# Altium schematic sheet pump_oil_schematic.SchDoc
size A3
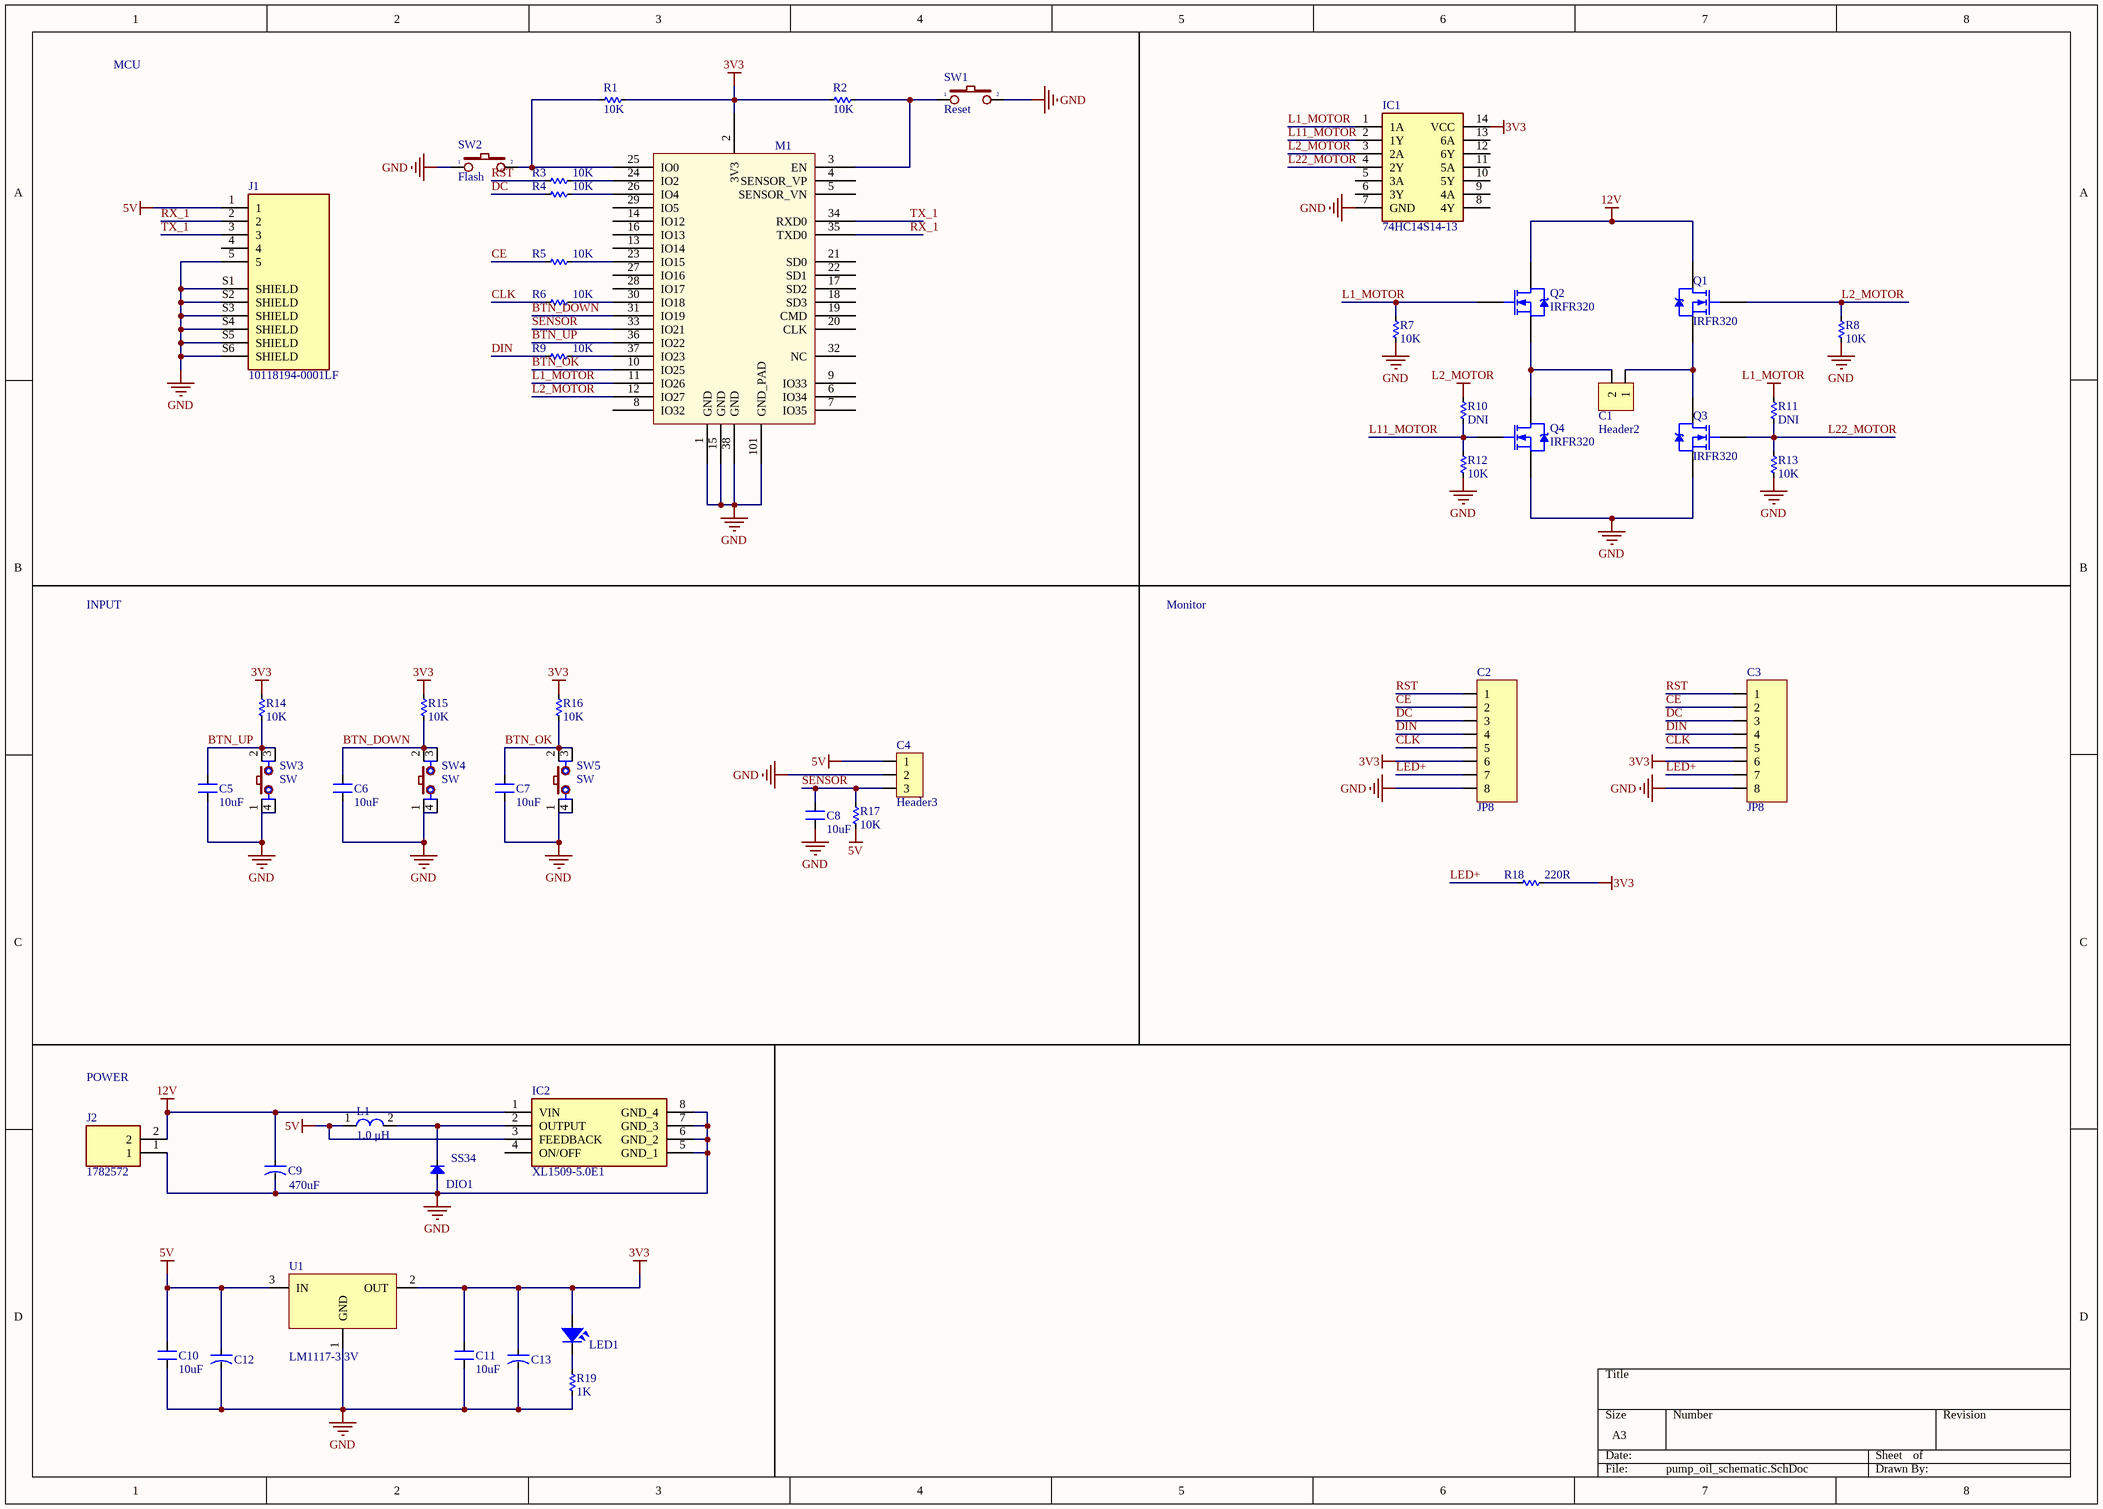
[diagram p0: pump_oil_schematic.SchDoc]

## Parts
C1  Header2  [Header2]
C2  JP8  [JP8-C1T]
C3  JP8  [JP8-C1T]
C4  Header3  [Header3]
C5  10uF  [CN-SMD-0603]
C6  10uF  [CN-SMD-0603]
C7  10uF  [CN-SMD-0603]
C8  10uF  [CN-SMD-0603]
C9  470uF  [CAP-ALU-SMD-6.3x7.7x2.2]
C10  10uF  [CN-SMD-0603]
C11  10uF  [CN-SMD-0603]
C12  CN-ALU-SMD  [CAP-ALU-SMD-4.5x5x1.4]  (value not drawn)
C13  CN-ALU-SMD  [CAP-ALU-SMD-4.5x5x1.4]  (value not drawn)
DIO1  SS34  [DIO-SMD-106]
IC1  74HC14S14-13  [SOIC127P600X173-14N]
IC2  XL1509-5.0E1  [SOIC127P600X175-8N]
J1  10118194-0001LF  [AMPHENOL_10118194-0001LF]
J2  1782572  [1782572]
L1  1.0 μH  [L-SMD-M-7.3x4.5]
LED1  LED  [LED-0805-Blue]  (value not drawn)
M1  ESP32S_Module  [ESP32S]  (value not drawn)
Q1  IRFR320  [TO-252AA_N]
Q2  IRFR320  [TO-252AA_N]
Q3  IRFR320  [TO-252AA_N]
Q4  IRFR320  [TO-252AA_N]
R1  10K  [RES-SMD-0603]
R2  10K  [RES-SMD-0603]
R3  10K  [RES-SMD-0603]
R4  10K  [RES-SMD-0603]
R5  10K  [RES-SMD-0603]
R6  10K  [RES-SMD-0603]
R7  10K  [RES-SMD-0603]
R8  10K  [RES-SMD-0603]
R9  10K  [RES-SMD-0603]
R10  DNI  [RES-SMD-0603]
R11  DNI  [RES-SMD-0603]
R12  10K  [RES-SMD-0603]
R13  10K  [RES-SMD-0603]
R14  10K  [RES-SMD-0603]
R15  10K  [RES-SMD-0603]
R16  10K  [RES-SMD-0603]
R17  10K  [RES-SMD-0603]
R18  220R  [RES-SMD-0603]
R19  1K  [RES-SMD-0603]
SW1  Reset  [SW1-SMD]
SW2  Flash  [SW-DIP1-1]
SW3  SW  [SW2-SMD]
SW4  SW  [SW2-SMD]
SW5  SW  [SW2-SMD]
U1  LM1117-3.3V  [SOT223]

## Nets
3V3: C2.6 C3.6 C11.1 C13.1 IC1.14(VCC) LED1.1 M1.2(3V3) R1.1 R2.2 R14.1 R15.1 R16.1 R18.2 U1.2(OUT)
5V: C4.1 C10.1 C12.1 IC2.3(FEEDBACK) J1.1 L1.1 R17.2 U1.3(IN)
12V: C9.1 IC2.1(VIN) J2.2 Q1.4(D) Q2.4(D)
GND: C2.8 C3.8 C4.2 C5.2 C6.2 C7.2 C8.2 C9.2 C10.2 C11.2 C12.2 C13.2 DIO1.1(A) IC1.7(GND) IC2.5(GND_1) IC2.6(GND_2) IC2.7(GND_3) IC2.8(GND_4) J1.5 J1.S1(SHIELD) J1.S2(SHIELD) J1.S3(SHIELD) J1.S4(SHIELD) J1.S5(SHIELD) J1.S6(SHIELD) J2.1 M1.1(GND) M1.15(GND) M1.38(GND) M1.101(GND_PAD) Q3.3(S) Q4.3(S) R7.2 R8.2 R12.2 R13.2 R19.2 SW1.2 SW2.1 SW3.1 SW3.4 SW4.1 SW4.4 SW5.1 SW5.4 U1.1(GND)
L1_MOTOR: IC1.1(1A) M1.11(IO26) Q2.1(G) R7.1 R11.1
L2_MOTOR: IC1.3(2A) M1.12(IO27) Q1.1(G) R8.1 R10.1
BTN_DOWN: C6.1 M1.31(IO19) R15.2 SW4.2 SW4.3
BTN_OK: C7.1 M1.10(IO25) R16.2 SW5.2 SW5.3
BTN_UP: C5.1 M1.36(IO22) R14.2 SW3.2 SW3.3
CE: C2.2 C3.2 R5.1
CLK: C2.5 C3.5 R6.1
DC: C2.3 C3.3 R4.1
DIN: C2.4 C3.4 R9.1
L11_MOTOR: IC1.2(1Y) Q4.1(G) R10.2 R12.1
L22_MOTOR: IC1.4(2Y) Q3.1(G) R11.2 R13.1
LED+: C2.7 C3.7 R18.1
RST: C2.1 C3.1 R3.1
RX_1: J1.2 M1.35(TXD0)
SENSOR: C4.3 C8.1 M1.33(IO21) R17.1
TX_1: J1.3 M1.34(RXD0)
NetC1_1: C1.1 Q1.3(S) Q3.4(D)
NetC1_2: C1.2 Q2.3(S) Q4.4(D)
NetDIO1_2: DIO1.2(K) IC2.2(OUTPUT) L1.2
NetLED1_2: LED1.2 R19.1
NetM1_3: M1.3(EN) R2.1 SW1.1
NetM1_23: M1.23(IO15) R5.2
NetM1_24: M1.24(IO2) R3.2
NetM1_25: M1.25(IO0) R1.2 SW2.2
NetM1_26: M1.26(IO4) R4.2
NetM1_30: M1.30(IO18) R6.2
NetM1_37: M1.37(IO23) R9.2

Not connected (* = marked no-connect by the designer): IC1 5(3A) 6(3Y) 8(4Y) 9(4A) 10(5Y) 11(5A) 12(6Y) 13(6A); IC2 4(ON/OFF); J1 4; M1 4(SENSOR_VP) 5(SENSOR_VN) 6(IO34) 7(IO35) 8(IO32) 9(IO33) 13(IO14) 14(IO12) 16(IO13) 17(SD2) 18(SD3) 19(CMD) 20(CLK) 21(SD0) 22(SD1) 27(IO16) 28(IO17) 29(IO5) 32(NC)

## Notes on the sheet
- MCU
- INPUT
- Monitor
- POWER

## Library data of the parts
C1 = Header2: Header IDC, 2 x 1 Pin Vertical 2.54mm Pitch (Non-Boxed, Male); Manufacturer: W¨¹rth Elektronik eiSos GmbH; partNo: 613002143121; ComponentLink1 Description: Manufacturer; ComponentLink2 Description: Datasheet; NoPins: 02; Created Date: 29 March 2013; ComponentLink1URL: http://www.we-online.com; ComponentLink2URL: http://katalog.we-online.de/em/datasheet/6130xx143121.pdf; Created by: Karrer Zheng
C2 C3 = JP8: WR-PHD 2.54 mm Angled Socket Header; Manufacturer: W¨¹rth Elektronik eiSos GmbH; partNo: 613008143121; ComponentLink1 Description: Manufacturer; ComponentLink2 Description: Datasheet; NoPins: 08; Created Date: 29 March 2013; ComponentLink1URL: http://www.we-online.com; ComponentLink2URL: http://katalog.we-online.de/em/datasheet/6130xx143121.pdf; Created by: Karrer Zheng
C4 = Header3: Header IDC, 3 x 1 Pin Vertical 2.54mm Pitch (Non-Boxed, Male); Manufacturer: W¨¹rth Elektronik eiSos GmbH; partNo: 613002143121; ComponentLink1 Description: Manufacturer; ComponentLink2 Description: Datasheet; NoPins: 02; Created Date: 29 March 2013; ComponentLink1URL: http://www.we-online.com; ComponentLink2URL: http://katalog.we-online.de/em/datasheet/6130xx143121.pdf; Created by: Karrer Zheng
C5-C8 C10 C11 = CN: Tu gom; Value: 33pF
C9 C12 C13 = CN-ALU-SMD: Polarized Capacitor (Axial); Published: 8-Jun-2000; LatestRevisionDate: 17-Jul-2002; LatestRevisionNote: Re-released for DXP Platform.; PackageReference: POLAR0.8; Publisher: Altium Limited
DIO1 = Diode SMD: Default Diode; Code - JEDEC: DO-214-AB; Value: 1N5007; Published: 8-Jun-2000; Revision: July-2002: Re-released for DXP Platform.; Publisher: Altium Limited
IC1 = 74HC14S14-13: Integrated Circuit; Manufacturer_Name: Diodes Inc.; Datasheet Link: https://www.diodes.com/assets/Datasheets/74HC14.pdf; Height: 1.73mm; Manufacturer_Part_Number: 74HC14S14-13; Mouser Part Number: 621-74HC14S14-13; Mouser Price/Stock: https://www.mouser.co.uk/ProductDetail/Diodes-Incorporated/74HC14S14-13?qs=pYVYkI7xuRUBH%2FWwCrI0pA%3D%3D; Arrow Part Number: 74HC14S14-13; Arrow Price/Stock: https://www.arrow.com/en/products/74hc14s14-13/diodes-incorporated?region=nac
IC2 = XL1509-5.0E1: Integrated Circuit; Manufacturer_Name: XLSEMI; Datasheet Link: https://datasheet.lcsc.com/szlcsc/XLSEMI-XL1509-5-0E1_C61063.pdf; Height: 1.75mm; Manufacturer_Part_Number: XL1509-5.0E1
J1 = 10118194-0001LF: USB - micro B USB 2.0 Receptacle Connector 5 Position Surface Mount, Right Angle; Through Hole; MF: Amphenol ICC; Package: None; Price: None; Availability: Unavailable; MP: 10118194-0001LF; SnapEDA_Link: https://www.snapeda.com/parts/10118194-0001LF/Amphenol%20FCI/view-part/1413308/?ref=snap; Value: *
J2 = 1782572: Connector; Manufacturer_Name: Phoenix Contact; Datasheet Link: http://www.phoenixcontact.com/de/produkte/1782572/pdf; Height: 6.9mm; Manufacturer_Part_Number: 1782572; Mouser Part Number: 651-1782572; Mouser Price/Stock: https://www.mouser.com/Search/Refine.aspx?Keyword=651-1782572
L1 = L-SMD-1: partNo: 78477010; Manufacturer: Wurth Elektronik; Inductance: 1.0 μH; ComponentLink1Description: Manufacturer; ComponentLink1URL: http://www.we-online.de; Created by: Baojun Chen; Created Date: Nov.2015; ComponentLink2Description: Datasheet; ComponentLink2URL: http://katalog.we-online.de/pbs/datasheet/78477010.pdf
LED1 = LED SMD: Value: LED 3 - 5 ly 2 Colour
M1 = ESP32S_Module: Esp-32S; Datasheet: https://espressif.com/sites/default/files/documentation/esp_wroom_32_datasheet_en.pdf
Q1-Q4 = IRFR320: HEXFET Power MOSFET; Note: Pin 2 is trimmed and is electrically connected to Drain.; Published: 8-Jun-2000; LatestRevisionDate: 20-Nov-2009; LatestRevisionNote: IPC-7351 Footprint Added.; DatasheetVersion: PD-9.598A; PackageVersion: Feb-2003; PackageReference: TO-252AA; Publisher: Altium Limited; PackageDescription: 3-Pin HEXFET Package 2.28 mm Pitch, 9.9 mm Lead Span; Code_JEDEC: TO-252-AA; ComponentLink1Description: Manufacturer Link; ComponentLink1URL: http://www.irf.com/; ComponentLink2Description: Datasheet; ComponentLink2URL: http://www.irf.com/product-info/datasheets/data/irfr320.pdf
R1-R19 = Res-SMD: Resistor; Manufacturer: Generic Components; Class: Passive; Published: 08/06/2000; Publisher: Altium Hobart Technology Centre
SW1 SW2 = SW2: Switch button 2 pin; Value: SW chip 2 pin
SW3-SW5 = SW4: Switch button 4 pin; Value: Button chip 4 pin
U1 = LM1117: 800mA Low-Dropout Linear Regulator; Creator: Nguyen Ba Bien; Website: http://group3i.net